# Altium project RTM_4SFP_3QSFP.PrjPcb (part 2 of 2)

## Sheet uRFB_Connectors.SchDoc: uRFB
size 420 x 297 mm; Author: G.K.; CompanyName: WUT; DrawnBy: G.K.; Organization: CERN; Address1: Warsaw Univeristy of Technology; Address2: Nowowiejska 15/19; DocumentNumber: 8; Revision: -; SheetNumber: 8; SheetTotal: -; EDA_Number: ARTIQ; Projet: RTM 4SFP 3QSFP; ModifiedBy: -; CreateDate: XX/XX/XXXX; CheckedDate: -; Title2: connector; DivGrp: ISE; Designer: G.K.; ModifiedDate: -; ProjectName: RTM 4SFP 3QSFP
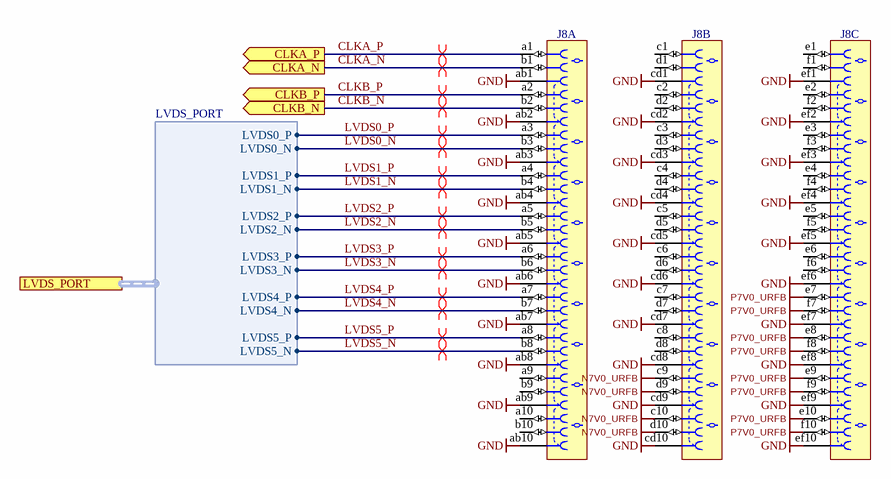
[diagram p5: uRFB_Connectors.SchDoc]

### Parts
J8  Hard Metric Type ZD  [ERNI_973028]  (value not drawn)  (parts A,B,C of 3)

### Ports
CLKA_N (out), CLKA_P (out), CLKB_N (out), CLKB_P (out), LVDS_PORT (harness LVDS_PORT)

### Harnesses
LVDS_PORT: LVDS0_P, LVDS0_N, LVDS1_P, LVDS1_N, LVDS2_P, LVDS2_N, LVDS3_P, LVDS3_N, LVDS4_P, LVDS4_N, LVDS5_P, LVDS5_N

### Nets
GND: J8.ab1 J8.ab2 J8.ab3 J8.ab4 J8.ab5 J8.ab6 J8.ab7 J8.ab8 J8.ab9 J8.ab10 J8.cd1 J8.cd2 J8.cd3 J8.cd4 J8.cd5 J8.cd6 J8.cd7 J8.cd8 J8.cd9 J8.cd10 J8.ef1 J8.ef2 J8.ef3 J8.ef4 J8.ef5 J8.ef6 J8.ef7 J8.ef8 J8.ef9 J8.ef10
N7V0_URFB: J8.c9 J8.c10 J8.d9 J8.d10
P7V0_URFB: J8.e7 J8.e8 J8.e9 J8.e10 J8.f7 J8.f8 J8.f9 J8.f10
CLKA_N: J8.b1 ; port CLKA_N
CLKA_P: J8.a1 ; port CLKA_P
CLKB_N: J8.b2 ; port CLKB_N
CLKB_P: J8.a2 ; port CLKB_P
LVDS0_N: J8.b3 ; port LVDS_PORT.LVDS0_N
LVDS0_P: J8.a3 ; port LVDS_PORT.LVDS0_P
LVDS1_N: J8.b4 ; port LVDS_PORT.LVDS1_N
LVDS1_P: J8.a4 ; port LVDS_PORT.LVDS1_P
LVDS2_N: J8.b5 ; port LVDS_PORT.LVDS2_N
LVDS2_P: J8.a5 ; port LVDS_PORT.LVDS2_P
LVDS3_N: J8.b6 ; port LVDS_PORT.LVDS3_N
LVDS3_P: J8.a6 ; port LVDS_PORT.LVDS3_P
LVDS4_N: J8.b7 ; port LVDS_PORT.LVDS4_N  [project net ADC1_SYNC_N]
LVDS4_P: J8.a7 ; port LVDS_PORT.LVDS4_P  [project net ADC1_SYNC_P]
LVDS5_N: J8.b8 ; port LVDS_PORT.LVDS5_N  [project net ADC2_SYNC_N]
LVDS5_P: J8.a8 ; port LVDS_PORT.LVDS5_P  [project net ADC2_SYNC_P]

Not connected (* = marked no-connect by the designer): J8 a9 a10 b9 b10 c1 c2 c3 c4 c5 c6 c7 c8 d1 d2 d3 d4 d5 d6 d7 d8 e1 e2 e3 e4 e5 e6 f1 f2 f3 f4 f5 f6

### Layout directives
differential pair; net class Diff_100Ohm: ADC1_SYNC_N, ADC1_SYNC_P, ADC2_SYNC_N, ADC2_SYNC_P, CLKA_N, CLKA_P, CLKB_N, CLKB_P, LVDS0_N, LVDS0_P, LVDS1_N, LVDS1_P, LVDS2_N, LVDS2_P, LVDS3_N, LVDS3_P

### Notes on the sheet
- Project/Equipment
- Document
- Designer
- Drawn by
- Check.by
- Copyright WUT ISE 2018.
  This documentation describes Open Hardware and is licensed under the CERN OHL v.1.1. You may redistribute and modify this documentation under the terms of the CERN OHL v.1.1. (http://ohwr.org/CERNOHL). This documentation is distributed WITHOUT ANY EXPRESS OR IMPLIED WARRANTY, INCLUDING OF MERCHANTABILITY, SATISFACTORY QUALITY AND FITNESS FOR A PARTICULAR PURPOSE. Please see the CERN OHL v.1.1 for applicable conditions.
- Contact
- File
- Last Mod.
- Print Date
- Sheet
- Size
- A3
- of
- Rev

### Library data of the parts
J8 = ERNI_973028: 90 Contacts, 6 Rows  (a,b,c,d,e,f) of 10 positions + 3 Shield Rows (ab, cd, ef) of 10 Positions, Pitch 2.5 mm,  Press-Fit, Right Angle ERmet ZD High Speed Differential Hard Metric Female Connector; Part Description: 90 Contacts (10x3 Pairs Signal Contacts + 3x10 Ground Contacts), Pitch 2.5mm, Press-Fit, Right Angle Ermet ZD High Speed Differential Hard Metric Female Connector; Manufacturer: ERNI; Manufacturer Part Number: 973028; Part Number: ERNI_973028; Component Kind: Standard; Component Type: Standard; Pin Count: 90; Family: Hard Metric Type ZD; Mounted: Yes; Socket: No; SMD: No; PressFit: Yes; Sense: No; Status: None; ComponentHeight: 16.9mm; HelpURL: \\cern.ch\dfs\Applications\Altium\Datasheets\ERNI_973028.pdf; Author: CERN DEM JLC; CreateDate: 18.04.2012; LatestRevisionDate: 18.04.2012

## Sheet QSFP.SchDoc: QSFP
size 420 x 297 mm; Author: G.K.; CompanyName: WUT; DrawnBy: G.K.; Organization: CERN; Address1: Warsaw Univeristy of Technology; Address2: Nowowiejska 15/19; DocumentNumber: 7; Revision: -; SheetNumber: 7; SheetTotal: -; EDA_Number: ARTIQ; Projet: RTM 4SFP 3QSFP; ModifiedBy: -; CreateDate: XX/XX/XXXX; CheckedDate: -; Title2: and I2C control; DivGrp: ISE; Designer: G.K.; ModifiedDate: -; ProjectName: RTM 4SFP 3QSFP
Used 3 times, as channels U_QSFPA, U_QSFPB, U_QSFPC. Parts and nets are listed once, with the designators drawn on the sheet.
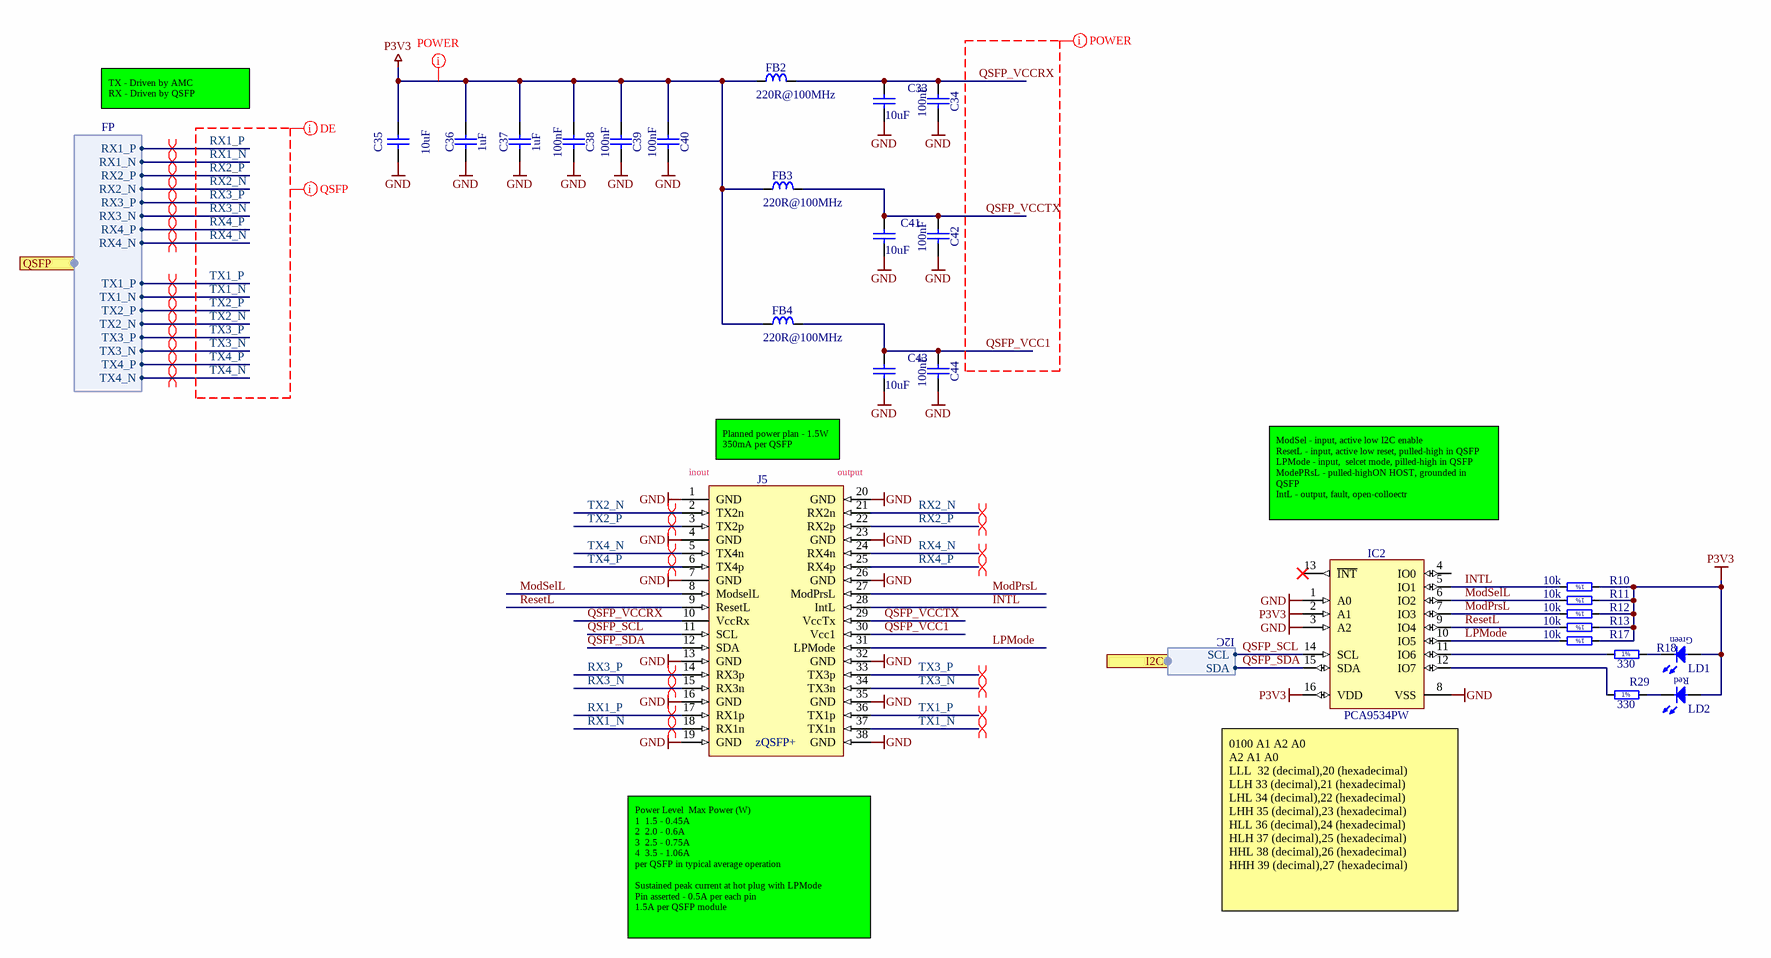
[diagram p6: QSFP.SchDoc]

### Parts
C33  10uF  [CAPC2012X135N]
C34  100nF  [CAPC0603X33N]
C35  10uF  [CAPC2012X135N]
C36  1uF  [CAPC1608X87N]
C37  1uF  [CAPC1608X87N]
C38  100nF  [CAPC0603X33N]
C39  100nF  [CAPC0603X33N]
C40  100nF  [CAPC0603X33N]
C41  10uF  [CAPC2012X135N]
C42  100nF  [CAPC0603X33N]
C43  10uF  [CAPC2012X135N]
C44  100nF  [CAPC0603X33N]
FB2  220R@100MHz  [INDC2012X105N]
FB3  220R@100MHz  [INDC2012X105N]
FB4  220R@100MHz  [INDC2012X105N]
IC2  PCA9534PW  [SOP65P640X110-16N]
J5  zQSFP+  [TYCO_1551920-2]
LD1  LED_AVAGO_HSME-C120  [LED_AVAGO_HSME-C120]  (value not drawn)
LD2  Red  [LED_AVAGO_HSME-C120rev]  (value not drawn)
R10  10k  [RESC1005X40N]
R11  10k  [RESC1005X40N]
R12  10k  [RESC1005X40N]
R13  10k  [RESC1005X40N]
R17  10k  [RESC1005X40N]
R18  330  [RESC1608X55N]
R29  330  [RESC1608X55N]

### Ports
I2C (harness I2C), QSFP (harness FP)

### Harnesses
FP: RX1_P, RX1_N, RX2_N, RX2_P, TX1_P, TX1_N, TX2_N, TX2_P, RX3_P, RX3_N, RX4_N, RX4_P, TX3_P, TX3_N, TX4_N, TX4_P
I2C: SCL, SDA

### Nets
GND: C33.2 C34.2 C35.2 C36.1 C37.1 C38.2 C39.2 C40.2 C41.2 C42.2 C43.2 C44.2 IC2.1(A0) IC2.3(A2) IC2.8(VSS) J5.1(GND) J5.4(GND) J5.7(GND) J5.13(GND) J5.16(GND) J5.19(GND) J5.20(GND) J5.23(GND) J5.26(GND) J5.32(GND) J5.35(GND) J5.38(GND)
P3V3: C35.1 C36.2 C37.2 C38.1 C39.1 C40.1 FB2.1 FB3.1 FB4.1 IC2.2(A1) IC2.16(VDD) LD1.2(A) LD2.1(A) R10.1 R11.1 R12.1 R13.1 R17.1
INTL: IC2.5(IO1) J5.28(IntL) R10.2
LPMode: IC2.10(IO5) J5.31(LPMode) R17.2
ModPrsL: IC2.7(IO3) J5.27(ModPrsL) R12.2
ModSelL: IC2.6(IO2) J5.8(ModselL) R11.2
QSFP_SCL: IC2.14(SCL) J5.11(SCL) ; port I2C.SCL
QSFP_SDA: IC2.15(SDA) J5.12(SDA) ; port I2C.SDA
QSFP_VCC1: C43.1 C44.1 FB4.2 J5.30(Vcc1)
QSFP_VCCRX: C33.1 C34.1 FB2.2 J5.10(VccRx)
QSFP_VCCTX: C41.1 C42.1 FB3.2 J5.29(VccTx)
ResetL: IC2.9(IO4) J5.9(ResetL) R13.2
RX1_N: J5.18(RX1n) ; port QSFP.RX1_N
RX1_P: J5.17(RX1p) ; port QSFP.RX1_P
RX2_N: J5.21(RX2n) ; port QSFP.RX2_N
RX2_P: J5.22(RX2p) ; port QSFP.RX2_P
RX3_N: J5.15(RX3n) ; port QSFP.RX3_N
RX3_P: J5.14(RX3p) ; port QSFP.RX3_P
RX4_N: J5.24(RX4n) ; port QSFP.RX4_N
RX4_P: J5.25(RX4p) ; port QSFP.RX4_P
TX1_N: J5.37(TX1n) ; port QSFP.TX1_N
TX1_P: J5.36(TX1p) ; port QSFP.TX1_P
TX2_N: J5.2(TX2n) ; port QSFP.TX2_N
TX2_P: J5.3(TX2p) ; port QSFP.TX2_P
TX3_N: J5.34(TX3n) ; port QSFP.TX3_N
TX3_P: J5.33(TX3p) ; port QSFP.TX3_P
TX4_N: J5.5(TX4n) ; port QSFP.TX4_N
TX4_P: J5.6(TX4p) ; port QSFP.TX4_P
NetIC2_11: IC2.11(IO6) R18.1
NetIC2_12: IC2.12(IO7) R29.1
NetLD1_1: LD1.1(C) R18.2
NetLD2_2: LD2.2(C) R29.2

Not connected (* = marked no-connect by the designer): IC2 4(IO0) 13(~{INT})*

### Channels
U_QSFPA: designators end in A
U_QSFPB: designators end in B
U_QSFPC: designators end in C

### Layout directives
differential pair: GTP4RX_N, GTP4RX_P, GTP4TX_N, GTP4TX_P, GTP5RX_N, GTP5RX_P, GTP5TX_N, GTP5TX_P, GTP6RX_N, GTP6RX_P, GTP6TX_N, GTP6TX_P, GTP7RX_N, GTP7RX_P, GTP7TX_N, GTP7TX_P
net class POWER: P3V3, QSFP_VCC1, QSFP_VCCRX, QSFP_VCCTX
net class QSFP: RX1_N, RX1_P, RX2_N, RX2_P, RX3_N, RX3_P, RX4_N, RX4_P, TX1_N, TX1_P, TX2_N, TX2_P, TX3_N, TX3_P, TX4_N, TX4_P
net class DE: RX1_N, RX1_P, RX2_N, RX2_P, RX3_N, RX3_P, RX4_N, RX4_P, TX1_N, TX1_P, TX2_N, TX2_P, TX3_N, TX3_P, TX4_N, TX4_P

### Notes on the sheet
- TX - Driven by AMC
  RX - Driven by QSFP
- Planned power plan - 1.5W
  350mA per QSFP
- (near J5) inout
- (near J5) output
- ModSel - input, active low I2C enable
  ResetL - input, active low reset, pulled-high in QSFP
  LPMode - input,  selcet mode, pilled-high in QSFP
  ModePRsL - pulled-highON HOST, grounded in QSFP
  IntL - output, fault, open-colloectr
- (near IC2) 0100 A1 A2 A0
  A2 A1 A0
  LLL 	32 (decimal),20 (hexadecimal)
  LLH	33 (decimal),21 (hexadecimal)
  LHL	34 (decimal),22 (hexadecimal)
  LHH	35 (decimal),23 (hexadecimal)
  HLL	36 (decimal),24 (hexadecimal)
  HLH	37 (decimal),25 (hexadecimal)
  HHL	38 (decimal),26 (hexadecimal)
  HHH	39 (decimal),27 (hexadecimal)
- Power Level  Max Power (W)
  1  1.5 - 0.45A
  2  2.0 - 0.6A
  3  2.5 - 0.75A
  4  3.5 - 1.06A
  per QSFP in typical average operation
  Sustained peak current at hot plug with LPMode
  Pin asserted - 0.5A per each pin
  1.5A per QSFP module
- Project/Equipment
- Document
- Designer
- Drawn by
- Check.by
- Copyright WUT ISE 2018.
  This documentation describes Open Hardware and is licensed under the CERN OHL v.1.1. You may redistribute and modify this documentation under the terms of the CERN OHL v.1.1. (http://ohwr.org/CERNOHL). This documentation is distributed WITHOUT ANY EXPRESS OR IMPLIED WARRANTY, INCLUDING OF MERCHANTABILITY, SATISFACTORY QUALITY AND FITNESS FOR A PARTICULAR PURPOSE. Please see the CERN OHL v.1.1 for applicable conditions.
- Contact
- File
- Last Mod.
- Print Date
- Sheet
- Size
- A3
- of
- Rev
- (in symbol R0402_10K_1%_0.0625W_100PPM) 1%
- (in symbol R0603_330R_1%_0.1W_100PPM) 1%

### Library data of the parts
C33 C35 C41 C43 = CC0805_10UF_10V_10%_X7R: Non-polarised capacitor; Part Description: SMD Multilayer Chip Ceramic Capacitor; Manufacturer: GENERIC; Manufacturer1 Part Number: GRM21BR71A106KE51L; Voltage: 10V; TC: X7R; Tolerance: ±10%; Table: Capacitors SMD; Part Number: CC0805_10UF_10V_10%_X7R; Component Kind: Standard; Component Type: Standard; Pin Count: 2; Value: 10uF; Status: Preferred; Manufacturer Part Number: CC0805_10UF_10V_10%_X7R; Case: 0805; Mounted: Yes; Socket: No; SMD: Yes; Manufacturer1 Example: MURATA; Manufacturer1 ComponentHeight: 1.35mm; HelpURL: \\cern.ch\dfs\Applications\Altium\Datasheets\CC0805_X7R_MURATA.pdf; Author: CERN DEM JLC; CreateDate: 2012-04-30; LatestRevisionDate: 2012-04-30
C34 C38-C40 C42 C44 = CC0201_100NF_6.3V_10%_X5R: Non-polarised capacitor; Part Description: SMD Multilayer Chip Ceramic Capacitor; Manufacturer: GENERIC; Manufacturer1 Part Number: 02016D104KAT2A; Voltage: 6.3V; TC: X5R; Tolerance: ±10%; Table: Capacitors SMD; Part Number: CC0201_100NF_6.3V_10%_X5R; Component Kind: Standard; Component Type: Standard; Pin Count: 2; Value: 100nF; Status: Not Recommended; Manufacturer Part Number: CC0201_100NF_6.3V_10%_X5R; Case: 0201; Mounted: Yes; Socket: No; SMD: Yes; Manufacturer1 Example: AVX; Manufacturer1 ComponentHeight: 0.33mm; HelpURL: \\cern.ch\dfs\Applications\Altium\Datasheets\CC0201_X5R_AVX.pdf; Author: CERN DEM JLC; CreateDate: 2007-12-03; LatestRevisionDate: 2007-12-03
C36 C37 = CC0603_1UF_25V_10%_X7R: Non-polarised capacitor; Part Description: SMD Multilayer Chip Ceramic Capacitor; Manufacturer: GENERIC; Manufacturer1 Part Number: GRM188R71E105KA12D; Voltage: 25V; TC: X7R; Tolerance: ±10%; Table: Capacitors SMD; Part Number: CC0603_1UF_25V_10%_X7R; Component Kind: Standard; Component Type: Standard; Pin Count: 2; Value: 1uF; Status: None; Manufacturer Part Number: CC0603_1UF_25V_10%_X7R; Case: 0603; Mounted: Yes; Socket: No; SMD: Yes; Manufacturer1 Example: MURATA; Manufacturer1 ComponentHeight: 0.9mm; HelpURL: \\cern.ch\dfs\Applications\Altium\Datasheets\CC0603_X7R_MURATA.pdf; Author: CERN DEM JLC; CreateDate: 2011-01-18; LatestRevisionDate: 2011-01-18
FB2-FB4 = IND0805_MURATA_BLM21PG221SN1D: Inductor; Part Description: SMD EMIFIL Suppression Chip Ferrite Bead; Manufacturer: MURATA; Power: 2A; Resistance: 0.05R; Tolerance: ±25%; Table: Inductors SMD; Part Number: IND0805_MURATA_BLM21PG221SN1D; Component Kind: Standard; Component Type: Standard; Pin Count: 2; Value: 220R@100MHz; Status: None; Manufacturer Part Number: BLM21PG221SN1D; Case: 0805; Mounted: Yes; Socket: No; SMD: Yes; ComponentHeight: 1.05mm; HelpURL: \\cern.ch\dfs\Applications\Altium\Datasheets\IND0402_MURATA_BLM21P.pdf; Author: CERN DEM JLC; CreateDate: 2010-01-25; LatestRevisionDate: 2010-01-25
IC2 = PCA9534PW: 8-Bit I2C-Bus and SMBus Low Power I/O Port with Interrupt; Manufacturer: ANALOG DEVICES; PressFit: No; Bonding: No; Table: Analog & Interface; Part Number: PCA9534PW; Component Kind: Standard; Component Type: Standard; Device: PCA9534PW; PackageDescription: SOP, 0.65mm pitch; 16 pin, 4.40mm W X 5.00mm L X 1.10mm H body IPC Medium Density; Part Description: 8-Bit I2C-Bus and SMBus Low Power I/O Port with Interrupt; Manufacturer Part Number: PCA9534PW; Pin Count: 16; Case: SSOP16; Mounted: Yes; Socket: No; SMD: Yes; ComponentHeight: 1.1mm; Author: CERN DEM JLC; HelpURL: \\cern.ch\dfs\Applications\Altium\Datasheets\PCA9534PW.pdf; CreateDate: 2013-12-18; LatestRevisionDate: 2013-12-18
J5 = TYCO_1551920-2: 38Position QSFP Connector  (Quad Small Form-factor Pluggable); Part Description: 38 Positions, Pitch 0.8mm zSFP+ Receptacle (Small Form-factor Pluggable); Manufacturer: TYCO ELECTRONICS; PressFit: No; Part Number: TYCO_1551920-2; Component Kind: Standard; Component Type: Standard; Pin Count: 38; Family: zQSFP+; Mounted: Yes; Socket: No; SMD: No; Sense: No; Status: None; Manufacturer Part Number: 1551920-2; ComponentHeight: 6.1mm; HelpURL: \\cern.ch\dfs\Applications\Altium\Datasheets\TYCO_1551920-2.pdf; Author: CERN DEM JLC; CreateDate: 24.05.2018; LatestRevisionDate: 24.05.2018
LD1 = LED_AVAGO_HSME-C120: LED Green 1C 2A; Part Description: High Performance Right Angle Chip Green LED; Manufacturer: AVAGO TECHNOLOGIES; Table: LEDs & Displays; Part Number: LED_AVAGO_HSME-C120; Component Kind: Standard; Component Type: Standard; Color: Green; PackageDescription: Green Chip LED, 2-Leads, Body 1.7x1.1mm, Side Emitting Package; Manufacturer Part Number: HSME-C120; Pin Count: 2; Mounted: Yes; Socket: No; SMD: Yes; ComponentHeight: 0.7mm; HelpURL: \\cern.ch\dfs\Applications\Altium\Datasheets\LED_AVAGO_HSME-C120.pdf; ComponentLink1URL: \\cern.ch\dfs\Applications\Altium\Datasheets\LED_AVAGO_HSME-C110_DESIGN-GUIDE.pdf; ComponentLink1Description: Design Guide; Author: CERN DEM JMW; CreateDate: 2009-07-22; LatestRevisionDate: 2012-06-20
LD2 = LED_SMD_90deg_mini_R: LED Red Avago C120; Part Number: LED_AVAGO_HSMC-C120; Part Description: High Performance Right Angle Chip Red LED; Manufacturer: AVAGO TECHNOLOGIES; Manufacturer Part Number: HSMC-C120; Table: LEDs & Displays; Component Kind: Standard; Component Type: Standard; Color: Red; Footprint: LED_AVAGO_HSMC-C120; PackageDescription: Red Chip LED, 2-Leads, Body 1.7x1.1mm, Side Emitting Package; Pin Count: 2; Mounted: Yes; Socket: No; SMD: Yes; ComponentHeight: 0.7mm; HelpURL: \\cern.ch\dfs\Applications\Altium\Datasheets\LED_AVAGO_HSME-C120.pdf; ComponentLink1URL: \\cern.ch\dfs\Applications\Altium\Datasheets\LED_AVAGO_HSME-C110_DESIGN-GUIDE.pdf; ComponentLink1Description: Design Guide; Author: CERN DEM JMW; CreateDate: 2009-07-22; LatestRevisionDate: 2012-06-20
R10-R13 R17 = R0402_10K_1%_0.0625W_100PPM: Resistor - 1%; Part Description: General Purpose Thick Film Chip Resistor; Manufacturer: GENERIC; Manufacturer1 Part Number: 232270671003L; TC: ±100ppm/°C; Table: Resistors SMD; Part Number: R0402_10K_1%_0.0625W_100PPM; Component Kind: Standard; Component Type: Standard; Pin Count: 2; Value: 10k; Status: Not recommended; Power: 0.0625W; Tolerance: ±1%; Manufacturer Part Number: R0402_10K_1%_0.0625W_100PPM; Case: 0402; Mounted: Yes; Socket: No; SMD: Yes; Manufacturer1 Example: YAGEO PHYCOMP; Manufacturer1 ComponentHeight: 0.4mm; HelpURL: \\cern.ch\dfs\Applications\Altium\Datasheets\R0402_Phycomp_RC0402.pdf; Author: CERN DEM JLC; CreateDate: 2007-12-03; LatestRevisionDate: 2012-10-17
R18 R29 = R0603_330R_1%_0.1W_100PPM: Resistor - 1%; Part Description: General Purpose Thick Film Chip Resistor; Manufacturer: GENERIC; Manufacturer1 Part Number: NRC06F3300TRF; Power: 0.1W; TC: ±100ppm/°C; Table: Resistors SMD; Part Number: R0603_330R_1%_0.1W_100PPM; Component Kind: Standard; Component Type: Standard; Pin Count: 2; Value: 330; Status: Preferred; Tolerance: ±1%; Manufacturer Part Number: R0603_330R_1%_0.1W_100PPM; Case: 0603; Mounted: Yes; Socket: No; SMD: Yes; Manufacturer1 Example: NIC COMPONENT; Manufacturer1 ComponentHeight: 0.55mm; HelpURL: \\cern.ch\dfs\Applications\Altium\Datasheets\R0603_NIC_NRC.pdf; Author: CERN DEM JLC; CreateDate: 2007-12-03; LatestRevisionDate: 2008-03-13

## Sheet PWR.SchDoc: Power
size 420 x 297 mm; Author: G.K.; CompanyName: WUT; DrawnBy: G.K.; Organization: CERN; Address1: Warsaw Univeristy of Technology; Address2: Nowowiejska 15/19; DocumentNumber: 3; Revision: -; SheetNumber: 3; SheetTotal: -; EDA_Number: ARTIQ; Projet: RTM 4SFP 3QSFP; ModifiedBy: -; CreateDate: XX/XX/XXXX; CheckedDate: -; Title2: Supply 3.3V 6A; DivGrp: ISE; Designer: G.K.; ModifiedDate: -; ProjectName: RTM 4SFP 3QSFP
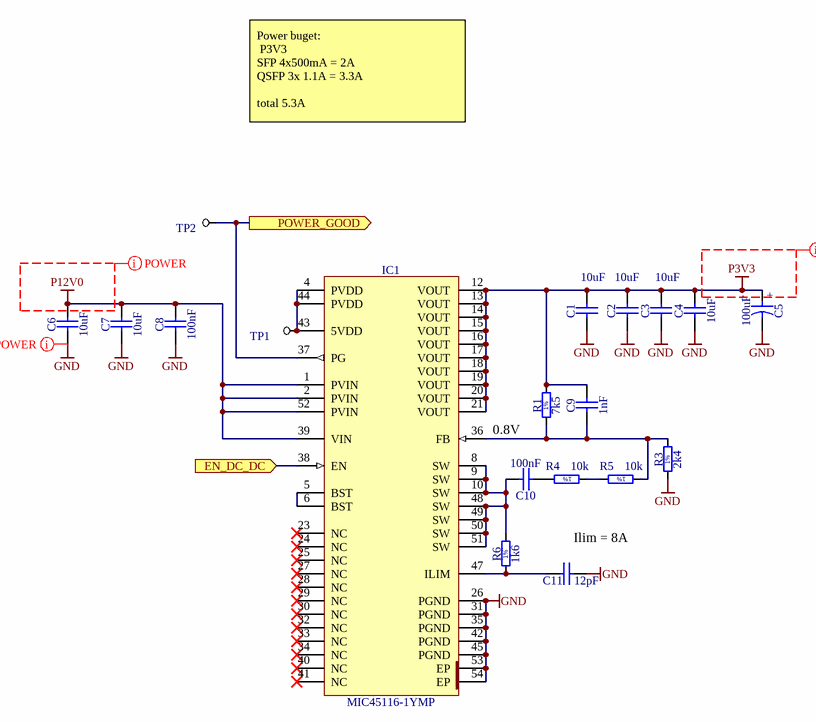
[diagram p7: PWR.SchDoc]

### Parts
C1  10uF  [CAPC2012X135N]
C2  10uF  [CAPC2012X135N]
C3  10uF  [CAPC2012X135N]
C4  10uF  [CAPC2012X135N]
C5  100uF  [CAPAE660X540N]
C6  10uF  [CAPC3216X140N]
C7  10uF  [CAPC3216X140N]
C8  100nF  [CAPC1005X55N]
C9  1nF  [CAPC1005X55N]
C10  100nF  [CAPC1005X55N]
C11  12pF  [CAPC1005X55N]
IC1  MIC45116-1YMP  [MICROCHIP_H3QFN88-52LD-PL-3]
R1  7k5  [RESC1005X40N]
R3  2k4  [RESC1005X40N]
R4  10k  [RESC1005X40N]
R5  10k  [RESC1005X40N]
R6  1k6  [RESC1005X40N]
TP1  TP  [TP]  (value not drawn)
TP2  TP  [TP]  (value not drawn)

### Ports
EN_DC_DC (in), POWER_GOOD (out)

### Nets
GND: C1.1 C2.1 C3.1 C4.1 C5.2 C6.1 C7.1 C8.1 C11.1 IC1.26(PGND) IC1.31(PGND) IC1.35(PGND) IC1.42(PGND) IC1.45(PGND) IC1.53(EP) IC1.54(EP) R3.1
P3V3: C1.2 C2.2 C3.2 C4.2 C5.1 C9.2 IC1.12(VOUT) IC1.13(VOUT) IC1.14(VOUT) IC1.15(VOUT) IC1.16(VOUT) IC1.17(VOUT) IC1.18(VOUT) IC1.19(VOUT) IC1.20(VOUT) IC1.21(VOUT) R1.2
P12V0: C6.2 C7.2 C8.2 IC1.1(PVIN) IC1.2(PVIN) IC1.39(VIN) IC1.52(PVIN)
NetC9_1: C9.1 IC1.36(FB) R1.1 R3.2 R5.1
NetC10_1: C10.1 R4.2
NetC10_2: C10.2 IC1.8(SW) IC1.9(SW) IC1.10(SW) IC1.48(SW) IC1.49(SW) IC1.50(SW) IC1.51(SW) R6.2
NetC11_2: C11.2 IC1.47(ILIM) R6.1
NetD1_2: IC1.38(EN) ; port EN_DC_DC
NetIC1_4: IC1.4(PVDD) IC1.43(5VDD) IC1.44(PVDD) TP1.1
NetIC1_5: IC1.5(BST) IC1.6(BST)
NetIC1_37: IC1.37(PG) TP2.1 ; port POWER_GOOD
NetR4_1: R4.1 R5.2

Not connected (* = marked no-connect by the designer): IC1 23(NC)* 24(NC)* 25(NC)* 27(NC)* 28(NC)* 29(NC)* 30(NC)* 32(NC)* 33(NC)* 34(NC)* 40(NC)* 41(NC)*

### Layout directives
net class POWER: GND, P3V3, P12V0

### Notes on the sheet
- Power buget:
  P3V3
  SFP	4x500mA = 2A
  QSFP	3x 1.1A = 3.3A
  total	5.3A
- 0.8V
- (near C11) Ilim = 8A
- Project/Equipment
- Document
- Designer
- Drawn by
- Check.by
- Copyright WUT ISE 2018.
  This documentation describes Open Hardware and is licensed under the CERN OHL v.1.1. You may redistribute and modify this documentation under the terms of the CERN OHL v.1.1. (http://ohwr.org/CERNOHL). This documentation is distributed WITHOUT ANY EXPRESS OR IMPLIED WARRANTY, INCLUDING OF MERCHANTABILITY, SATISFACTORY QUALITY AND FITNESS FOR A PARTICULAR PURPOSE. Please see the CERN OHL v.1.1 for applicable conditions.
- Contact
- File
- Last Mod.
- Print Date
- Sheet
- Size
- A3
- of
- Rev
- (in symbol CAE660-540_100UF_16V_20%) +
- (in symbol R0402_1K6_1%_0.0625W_100PPM) 1%
- (in symbol R0402_2K4_1%_0.0625W_100PPM) 1%
- (in symbol R0402_7K5_1%_0.0625W_100PPM) 1%
- (in symbol R0402_10K_1%_0.0625W_100PPM) 1%

### Library data of the parts
C1-C4 = CC0805_10UF_10V_10%_X7R: as C33 on sheet QSFP; Part Number: CC0805_10UF_10V_10%_X7R; Component Kind: Standard; Component Type: Standard; Pin Count: 2; Value: 10uF; Status: Preferred; Manufacturer Part Number: CC0805_10UF_10V_10%_X7R; Case: 0805; Mounted: Yes; Socket: No; SMD: Yes; Manufacturer1 Example: MURATA; Manufacturer1 ComponentHeight: 1.35mm; HelpURL: \\cern.ch\dfs\Applications\Altium\Datasheets\CC0805_X7R_MURATA.pdf; Author: CERN DEM JLC; CreateDate: 2012-04-30; LatestRevisionDate: 2012-04-30
C5 = CAE660-540_100UF_16V_20%: Polarised capacitor; Part Description: Aluminum Electrolytic SMT Capacitor; Manufacturer: PANASONIC; Manufacturer Part Number: EEEFK1C101AP; Voltage: 16V; Tolerance: ±20%; Part Number: CAE660-540_100UF_16V_20%; Component Kind: Standard; Component Type: Standard; Pin Count: 2; Value: 100uF; Status: Not Recommended; Case: D; Mounted: Yes; Socket: No; SMD: Yes; Sense: No; ComponentHeight: 5.8mm; HelpURL: \\cern.ch\dfs\Applications\Altium\Datasheets\CAE_PANASONIC_FK.pdf; Author: CERN DEM JLC; CreateDate: 03.12.2007; LatestRevisionDate: 05.11.2014
C6 C7 = CC1206_10UF_16V_10%_X7R: Non-polarised capacitor; Part Description: SMD Multilayer Chip Ceramic Capacitor; Manufacturer: GENERIC; Manufacturer1 Part Number: C1206C106K4RAC; Voltage: 16V; TC: X7R; Tolerance: ±10%; Table: Capacitors SMD; Part Number: CC1206_10UF_16V_10%_X7R; Component Kind: Standard; Component Type: Standard; Pin Count: 2; Value: 10uF; Status: Preferred; Manufacturer Part Number: CC1206_10uF_16V_10%_X7R; Case: 1206; Mounted: Yes; Socket: No; SMD: Yes; Manufacturer1 Example: KEMET; Manufacturer1 ComponentHeight: 1.8mm; HelpURL: \\cern.ch\dfs\Applications\Altium\Datasheets\CC1206_X7R_KEMET.pdf; Author: CERN DEM JLC; CreateDate: 2009-04-28; LatestRevisionDate: 2009-04-28
C8 C10 = CC0402_100NF_16V_10%_X5R: Non-polarised capacitor; Part Description: SMD Multilayer Chip Ceramic Capacitor; Manufacturer: GENERIC; Manufacturer1 Part Number: GRM155R61C104KA88D; Voltage: 16V; TC: X5R; Tolerance: ±10%; Table: Capacitors SMD; Part Number: CC0402_100NF_16V_10%_X5R; Component Kind: Standard; Component Type: Standard; Pin Count: 2; Value: 100nF; Status: None; Manufacturer Part Number: CC0402_100NF_16V_10%_X5R; Case: 0402; Mounted: Yes; Socket: No; SMD: Yes; Manufacturer1 Example: MURATA; Manufacturer1 ComponentHeight: 0.55mm; HelpURL: \\cern.ch\dfs\Applications\Altium\Datasheets\CC0402_X5R_MURATA_GRM.pdf; Author: CERN DEM JLC; CreateDate: 2013-12-10; LatestRevisionDate: 2013-12-10
C9 = CC0402_1NF_50V_10%_X7R: Non-polarised capacitor; Part Description: SMD Multilayer Chip Ceramic Capacitor; Manufacturer: GENERIC; Manufacturer1 Part Number: 223858715623; Voltage: 50V; TC: X7R; Tolerance: ±10%; Part Number: CC0402_1NF_50V_10%_X7R; Component Kind: Standard; Component Type: Standard; Pin Count: 2; Value: 1nF; Status: Not Recommended; Manufacturer Part Number: CC0402_1NF_50V_10%_X7R; Case: 0402; Mounted: Yes; Socket: No; SMD: Yes; Sense: No; Manufacturer1 Example: PHYCOMP; Manufacturer1 ComponentHeight: 0.55mm; HelpURL: \\cern.ch\dfs\Applications\Altium\Datasheets\CC0402_X7R_PHYCOMP.pdf; Author: CERN DEM JLC; CreateDate: 03.12.2007; LatestRevisionDate: 03.12.2007
C11 = CC0402_12PF_50V_5%_C0G: Non-polarised capacitor; Part Description: SMD Multilayer Chip Ceramic Capacitor; Manufacturer: GENERIC; Manufacturer1 Part Number: C0402C120J5GACTU; Voltage: 50V; TC: C0G/NP0; Tolerance: ±5%; Part Number: CC0402_12PF_50V_5%_C0G; Component Kind: Standard; Component Type: Standard; Pin Count: 2; Value: 12pF; Status: Preferred; Manufacturer Part Number: CC0402_12PF_50V_5%_C0G; Case: 0402; Mounted: Yes; Socket: No; SMD: Yes; Sense: No; Manufacturer1 Example: KEMET; Manufacturer1 ComponentHeight: 0.55mm; HelpURL: \\cern.ch\dfs\Applications\Altium\Datasheets\CC0805_C0G_KEMET_(Commercial Grade).pdf; Author: CERN DEM JLC; CreateDate: 04.10.2016; LatestRevisionDate: 04.10.2016
IC1 = MIC45116-1YMP: 0.8V to 85% PVIN (4.75-19V), 6A Synchronous Step-Down Regulator Module; Manufacturer: MICROCHIP TECHNOLOGY; PressFit: No; Bonding: No; Part Number: MIC45116-1YMP; Component Kind: Standard; Component Type: Standard; Device: MIC45116-1YMP; PackageDescription: MICROCHIP_H3QFN88-52LD-PL-3, 0.50mm Pitch, Square, 52 Pin, 8mm L X 8mm W X 3mm H Body; Part Description: 0.8V to 85% PVIN (4.75-19V), 6A Synchronous Step-Down Regulator Module; Manufacturer Part Number: MIC45116-1YMP; Pin Count: 53; Mounted: Yes; Socket: No; SMD: Yes; Sense: No; ComponentHeight: 3mm; HelpURL: \\cern.ch\dfs\Applications\Altium\Datasheets\MIC45116-1YMP.pdf; Author: CERN DEM JMW; CreateDate: 15.08.2016; LatestRevisionDate: 15.08.2016
R1 = R0402_7K5_1%_0.0625W_100PPM: Resistor - 1%; Part Description: General Purpose Thick Film Chip Resistor; Manufacturer: GENERIC; Manufacturer1 Part Number: 232270677502L; TC: ±100ppm/°C; PressFit: No; Part Number: R0402_7K5_1%_0.0625W_100PPM; Component Kind: Standard; Component Type: Standard; Pin Count: 2; Value: 7k5; Status: Not Recommended; Power: 0.0625W; Tolerance: ±1%; Manufacturer Part Number: R0402_7K5_1%_0.0625W_100PPM; Case: 0402; Mounted: Yes; Sense: No; Socket: No; SMD: Yes; Manufacturer1 Example: YAGEO PHYCOMP; Manufacturer1 ComponentHeight: 0.4mm; HelpURL: \\cern.ch\dfs\Applications\Altium\Datasheets\R0402_Phycomp_RC0402.pdf; Author: CERN DEM JLC; CreateDate: 03.12.2007; LatestRevisionDate: 17.10.2012
R3 = R0402_2K4_1%_0.0625W_100PPM: Resistor - 1%; Part Description: General Purpose Thick Film Chip Resistor; Manufacturer: GENERIC; Manufacturer1 Part Number: 232270672402L; TC: ±100ppm/°C; PressFit: No; Part Number: R0402_2K4_1%_0.0625W_100PPM; Component Kind: Standard; Component Type: Standard; Pin Count: 2; Value: 2k4; Status: Not Recommended; Power: 0.0625W; Tolerance: ±1%; Manufacturer Part Number: R0402_2K4_1%_0.0625W_100PPM; Case: 0402; Mounted: Yes; Sense: No; Socket: No; SMD: Yes; Manufacturer1 Example: YAGEO PHYCOMP; Manufacturer1 ComponentHeight: 0.4mm; HelpURL: \\cern.ch\dfs\Applications\Altium\Datasheets\R0402_Phycomp_RC0402.pdf; Author: CERN DEM JLC; CreateDate: 03.12.2007; LatestRevisionDate: 17.10.2012
R4 R5 = R0402_10K_1%_0.0625W_100PPM: as R10 on sheet QSFP; Part Number: R0402_10K_1%_0.0625W_100PPM; Component Kind: Standard; Component Type: Standard; Pin Count: 2; Value: 10k; Status: Not recommended; Power: 0.0625W; Tolerance: ±1%; Manufacturer Part Number: R0402_10K_1%_0.0625W_100PPM; Case: 0402; Mounted: Yes; Socket: No; SMD: Yes; Manufacturer1 Example: YAGEO PHYCOMP; Manufacturer1 ComponentHeight: 0.4mm; HelpURL: \\cern.ch\dfs\Applications\Altium\Datasheets\R0402_Phycomp_RC0402.pdf; Author: CERN DEM JLC; CreateDate: 2007-12-03; LatestRevisionDate: 2012-10-17
R6 = R0402_1K6_1%_0.0625W_100PPM: Resistor - 1%; Part Description: General Purpose Thick Film Chip Resistor; Manufacturer: GENERIC; Manufacturer1 Part Number: 232270671602L; TC: ±100ppm/°C; PressFit: No; Part Number: R0402_1K6_1%_0.0625W_100PPM; Component Kind: Standard; Component Type: Standard; Pin Count: 2; Value: 1k6; Status: Not Recommended; Power: 0.0625W; Tolerance: ±1%; Manufacturer Part Number: R0402_1K6_1%_0.0625W_100PPM; Case: 0402; Mounted: Yes; Sense: No; Socket: No; SMD: Yes; Manufacturer1 Example: YAGEO PHYCOMP; Manufacturer1 ComponentHeight: 0.4mm; HelpURL: \\cern.ch\dfs\Applications\Altium\Datasheets\R0402_Phycomp_RC0402.pdf; Author: CERN DEM JLC; CreateDate: 03.12.2007; LatestRevisionDate: 17.10.2012
TP1 TP2 = TP: Testpoint

## Nets that join several sheets
GND: RTM_4SFP_3QSFP_TOP (70 pins), U_SFP (18 pins), I2C_Switch (5 pins), U_SFP (18 pins), U_SFP (18 pins), U_SFP (18 pins), RTM_Connectors (67 pins), USR_IO_IPMI (27 pins), uRFB_Connectors (30 pins), U_QSFPA (27 pins), U_QSFPB (27 pins), U_QSFPC (27 pins), PWR (17 pins)
P3V3: U_SFP (14 pins), U_SFP (14 pins), U_SFP (14 pins), U_SFP (14 pins), U_QSFPA (18 pins), U_QSFPB (18 pins), U_QSFPC (18 pins), PWR (17 pins)
P3V3MP: I2C_Switch (19 pins), RTM_Connectors (J2.c2), USR_IO_IPMI (32 pins)
P12V0: RTM_Connectors (J2.a1 J2.a2 J2.b1 J2.b2), PWR (7 pins)
ADC1_SYNC_N: RTM_Connectors (J2.a6), uRFB_Connectors (J8.b7)
ADC1_SYNC_P: RTM_Connectors (J2.b6), uRFB_Connectors (J8.a7)
ADC2_SYNC_N: RTM_Connectors (J2.a5), uRFB_Connectors (J8.b8)
ADC2_SYNC_P: RTM_Connectors (J2.b5), uRFB_Connectors (J8.a8)
CLKA_N: RTM_Connectors (J2.b3), uRFB_Connectors (J8.b1)
CLKA_P: RTM_Connectors (J2.a3), uRFB_Connectors (J8.a1)
CLKB_N: RTM_Connectors (J4.b1), uRFB_Connectors (J8.b2)
CLKB_P: RTM_Connectors (J4.a1), uRFB_Connectors (J8.a2)
GTP0RX_N: U_SFP (CON1D.12), RTM_Connectors (J4.d10)
GTP0RX_P: U_SFP (CON1D.13), RTM_Connectors (J4.c10)
GTP0TX_N: U_SFP (CON1D.19), RTM_Connectors (J4.f10)
GTP0TX_P: U_SFP (CON1D.18), RTM_Connectors (J4.e10)
GTP1RX_N: U_SFP (CON1A.12), RTM_Connectors (J4.d9)
GTP1RX_P: U_SFP (CON1A.13), RTM_Connectors (J4.c9)
GTP1TX_N: U_SFP (CON1A.19), RTM_Connectors (J4.f9)
GTP1TX_P: U_SFP (CON1A.18), RTM_Connectors (J4.e9)
GTP2RX_N: U_SFP (CON1B.12), RTM_Connectors (J4.d8)
GTP2RX_P: U_SFP (CON1B.13), RTM_Connectors (J4.c8)
GTP2TX_N: U_SFP (CON1B.19), RTM_Connectors (J4.f8)
GTP2TX_P: U_SFP (CON1B.18), RTM_Connectors (J4.e8)
GTP3RX_N: U_SFP (CON1C.12), RTM_Connectors (J4.d7)
GTP3RX_P: U_SFP (CON1C.13), RTM_Connectors (J4.c7)
GTP3TX_N: U_SFP (CON1C.19), RTM_Connectors (J4.f7)
GTP3TX_P: U_SFP (CON1C.18), RTM_Connectors (J4.e7)
GTP4RX_N: RTM_Connectors (J4.d6), U_QSFPA (J5A.18)
GTP4RX_P: RTM_Connectors (J4.c6), U_QSFPA (J5A.17)
GTP4TX_N: RTM_Connectors (J4.f6), U_QSFPA (J5A.37)
GTP4TX_P: RTM_Connectors (J4.e6), U_QSFPA (J5A.36)
GTP5RX_N: RTM_Connectors (J4.d5), U_QSFPA (J5A.21)
GTP5RX_P: RTM_Connectors (J4.c5), U_QSFPA (J5A.22)
GTP5TX_N: RTM_Connectors (J4.f5), U_QSFPA (J5A.2)
GTP5TX_P: RTM_Connectors (J4.e5), U_QSFPA (J5A.3)
GTP6RX_N: RTM_Connectors (J4.d4), U_QSFPA (J5A.15)
GTP6RX_P: RTM_Connectors (J4.c4), U_QSFPA (J5A.14)
GTP6TX_N: RTM_Connectors (J4.f4), U_QSFPA (J5A.34)
GTP6TX_P: RTM_Connectors (J4.e4), U_QSFPA (J5A.33)
GTP7RX_N: RTM_Connectors (J4.d3), U_QSFPA (J5A.24)
GTP7RX_P: RTM_Connectors (J4.c3), U_QSFPA (J5A.25)
GTP7TX_N: RTM_Connectors (J4.f3), U_QSFPA (J5A.5)
GTP7TX_P: RTM_Connectors (J4.e3), U_QSFPA (J5A.6)
GTP8RX_N: RTM_Connectors (J4.d2), U_QSFPB (J5B.18)
GTP8RX_P: RTM_Connectors (J4.c2), U_QSFPB (J5B.17)
GTP8TX_N: RTM_Connectors (J4.f2), U_QSFPB (J5B.37)
GTP8TX_P: RTM_Connectors (J4.e2), U_QSFPB (J5B.36)
GTP9RX_N: RTM_Connectors (J4.d1), U_QSFPB (J5B.21)
GTP9RX_P: RTM_Connectors (J4.c1), U_QSFPB (J5B.22)
GTP9TX_N: RTM_Connectors (J4.f1), U_QSFPB (J5B.2)
GTP9TX_P: RTM_Connectors (J4.e1), U_QSFPB (J5B.3)
GTP10RX_N: RTM_Connectors (J2.d10), U_QSFPB (J5B.15)
GTP10RX_P: RTM_Connectors (J2.c10), U_QSFPB (J5B.14)
GTP10TX_N: RTM_Connectors (J2.f10), U_QSFPB (J5B.34)
GTP10TX_P: RTM_Connectors (J2.e10), U_QSFPB (J5B.33)
GTP11RX_N: RTM_Connectors (J2.d9), U_QSFPB (J5B.24)
GTP11RX_P: RTM_Connectors (J2.c9), U_QSFPB (J5B.25)
GTP11TX_N: RTM_Connectors (J2.f9), U_QSFPB (J5B.5)
GTP11TX_P: RTM_Connectors (J2.e9), U_QSFPB (J5B.6)
GTP12RX_N: RTM_Connectors (J2.d8), U_QSFPC (J5C.18)
GTP12RX_P: RTM_Connectors (J2.c8), U_QSFPC (J5C.17)
GTP12TX_N: RTM_Connectors (J2.f8), U_QSFPC (J5C.37)
GTP12TX_P: RTM_Connectors (J2.e8), U_QSFPC (J5C.36)
GTP13RX_N: RTM_Connectors (J2.d7), U_QSFPC (J5C.21)
GTP13RX_P: RTM_Connectors (J2.c7), U_QSFPC (J5C.22)
GTP13TX_N: RTM_Connectors (J2.f7), U_QSFPC (J5C.2)
GTP13TX_P: RTM_Connectors (J2.e7), U_QSFPC (J5C.3)
GTP14RX_N: RTM_Connectors (J2.d6), U_QSFPC (J5C.15)
GTP14RX_P: RTM_Connectors (J2.c6), U_QSFPC (J5C.14)
GTP14TX_N: RTM_Connectors (J2.f6), U_QSFPC (J5C.34)
GTP14TX_P: RTM_Connectors (J2.e6), U_QSFPC (J5C.33)
GTP15RX_N: RTM_Connectors (J2.d5), U_QSFPC (J5C.24)
GTP15RX_P: RTM_Connectors (J2.c5), U_QSFPC (J5C.25)
GTP15TX_N: RTM_Connectors (J2.f5), U_QSFPC (J5C.5)
GTP15TX_P: RTM_Connectors (J2.e5), U_QSFPC (J5C.6)
I2C_RESETn: I2C_Switch (IC39.24), USR_IO_IPMI (IC14.10 R36.2)
LVDS0_N: RTM_Connectors (J2.d4), uRFB_Connectors (J8.b3)
LVDS0_P: RTM_Connectors (J2.c4), uRFB_Connectors (J8.a3)
LVDS1_N: RTM_Connectors (J2.d3), uRFB_Connectors (J8.b4)
LVDS1_P: RTM_Connectors (J2.c3), uRFB_Connectors (J8.a4)
LVDS2_N: RTM_Connectors (J2.f4), uRFB_Connectors (J8.b5)
LVDS2_P: RTM_Connectors (J2.e4), uRFB_Connectors (J8.a5)
LVDS3_N: RTM_Connectors (J2.f3), uRFB_Connectors (J8.b6)
LVDS3_P: RTM_Connectors (J2.e3), uRFB_Connectors (J8.a6)
NetD1_2: USR_IO_IPMI (D1.2 R35.2 T1.3), PWR (IC1.38)
NetIC1_37: USR_IO_IPMI (R46.2 T2.1), PWR (IC1.37 TP2.1)
QSFP_SCL: I2C_Switch (IC39.11 R330.1), U_QSFPA (IC2A.14 J5A.11)
QSFP_SCL: I2C_Switch (IC39.13 R332.1), U_QSFPB (IC2B.14 J5B.11)
QSFP_SCL: I2C_Switch (IC39.15 R334.1), U_QSFPC (IC2C.14 J5C.11)
QSFP_SDA: I2C_Switch (IC39.10 R329.1), U_QSFPA (IC2A.15 J5A.12)
QSFP_SDA: I2C_Switch (IC39.12 R331.1), U_QSFPB (IC2B.15 J5B.12)
QSFP_SDA: I2C_Switch (IC39.14 R333.1), U_QSFPC (IC2C.15 J5C.12)
SCL: I2C_Switch (IC39.19 TP3.1), RTM_Connectors (J2.d2), USR_IO_IPMI (6 pins)
SDA: I2C_Switch (IC39.20 TP4.1), RTM_Connectors (J2.d1), USR_IO_IPMI (6 pins)
SFP_I2C_0.SCL: U_SFP (CON1A.5 IC3A.14), I2C_Switch (IC39.2 R317.1)
SFP_I2C_0.SDA: U_SFP (CON1A.4 IC3A.15), I2C_Switch (IC39.1 R316.1)
SFP_I2C_1.SCL: I2C_Switch (IC39.4 R319.1), U_SFP (CON1B.5 IC3B.14)
SFP_I2C_1.SDA: I2C_Switch (IC39.3 R318.1), U_SFP (CON1B.4 IC3B.15)
SFP_I2C_2.SCL: I2C_Switch (IC39.6 R321.1), U_SFP (CON1C.5 IC3C.14)
SFP_I2C_2.SDA: I2C_Switch (IC39.5 R320.1), U_SFP (CON1C.4 IC3C.15)
SFP_I2C_3.SCL: I2C_Switch (IC39.8 R323.1), U_SFP (CON1D.5 IC3D.14)
SFP_I2C_3.SDA: I2C_Switch (IC39.7 R322.1), U_SFP (CON1D.4 IC3D.15)